# EAGLE design power-bridge (EAGLE 9.5.1)
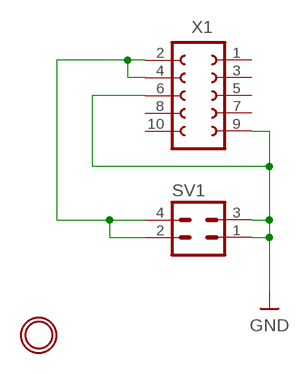
[diagram p0: schematic, sheet 1]

## Parts
SV1  CON-MA02-2  [MA02-2W]
U$2  MOUNTINGHOLE2.7_THICK  [MOUNTINGHOLE_2.7_PLATED_THICK]
X1  CON-FE05-2  [FE05-2]

## Nets
GND: SV1.1 SV1.3 X1.6 X1.9
PWR: SV1.2 SV1.4 X1.2 X1.4
Unconnected: X1.1 X1.3 X1.5 X1.7 X1.8 X1.10

## Library data of the parts
SV1 = sanisimov:CON-MA02-2: PIN HEADER
U$2 = sanisimov:MOUNTINGHOLE: Mounting Hole For #2 screws (0.086"/2.18mm width, 0.094"/2.4mm hole) use 2.5mm; BOM: EXCLUDE
X1 = sanisimov:CON-FE05-2: FEMALE HEADER

## Board
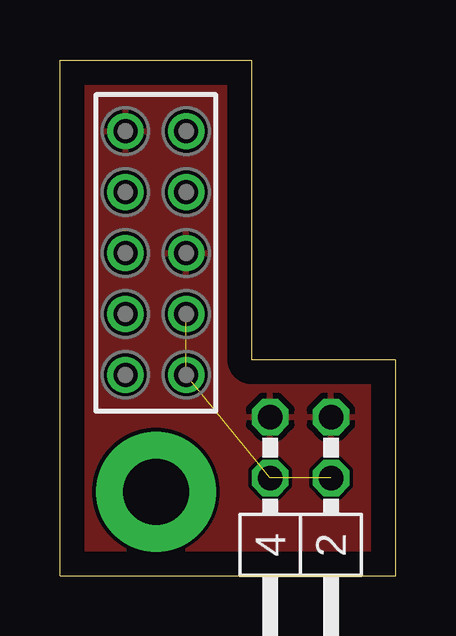
[diagram p1: board, top side]
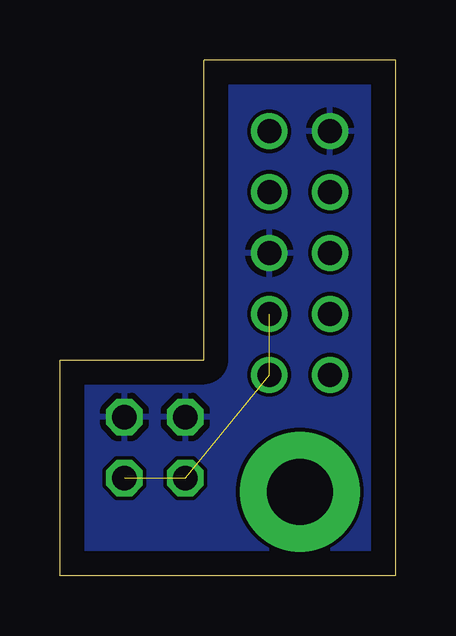
[diagram p2: board, bottom side, seen from below]

Size 14 x 21.5 mm. Coordinates in mm from the lower left corner, seen from the top.
Outline: 0,0 0,21.5 8,21.5 8,9 14,9 14,0 0,0
Copper layers (1*16): Top 0.035mm / dielectric 1.5mm / Bottom 0.035mm
Design rules "default *": minimum track width 6mil, minimum drill 0.35mm, track to track 6mil, track to pad 6mil, pad to pad 6mil, via to via 6mil, smd to smd 6mil, copper to edge 40mil, drill to drill 6mil, minimum pad ring 10mil, minimum via ring 8mil, stop-mask expansion 4mil, vias tented up to drill 15mil, thermal gap 10mil

### Footprints (pad centres in the part's own frame; a part is rotated, then mirrored left to right if it is on the bottom)
MA02-2W = drill 1.016 octagon: 1 -1.27,-1.27; 2 -1.27,1.27; 3 1.27,-1.27; 4 1.27,1.27
MOUNTINGHOLE_2.7_PLATED_THICK = drill 2.75 pad 5: P$1 0,0
FE05-2 = drill 1: 1 -5.08,1.27; 2 -5.08,-1.27; 3 -2.54,1.27; 4 -2.54,-1.27; 5 0,1.27; 6 0,-1.27; 7 2.54,1.27; 8 2.54,-1.27; 9 5.08,1.27; 10 5.08,-1.27

### Placement (x,y rotation side)
SV1  10.04,5.34 180 top
U$2  4,3.5 0 top
X1  4,13.45 90 top

### Tracks (layer width: path | path; a pad name or v marks a point on that pad's centre or on a via)
GND
  pour Bottom: -1.73,22.79 14.97,22.79 14.97,-1.58 -1.73,-1.58
  pour Top: -1.73,22.79 14.97,22.79 14.97,-1.58 -1.73,-1.58
PWR  (3 unrouted)